# EAGLE schematic motion-sensor (EAGLE 7.4.0)
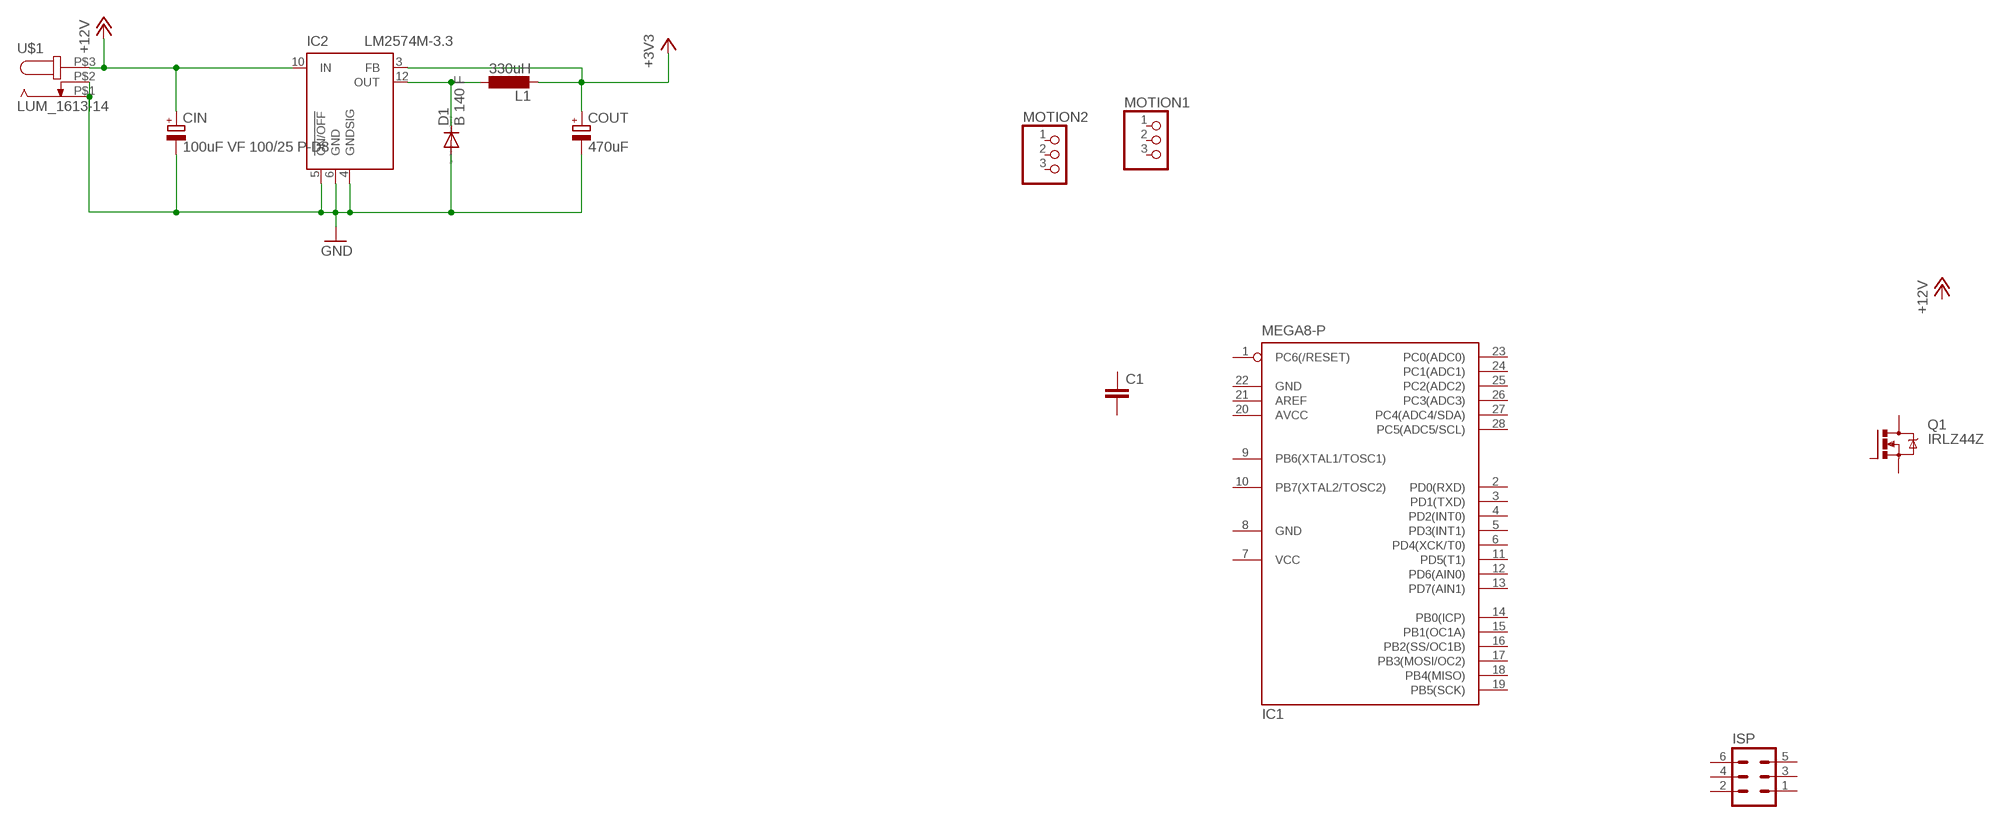
[diagram p0: schematic, sheet 1]

## Parts
C1  C-EU025-030X050  [C025-030X050]
CIN  100uF VF 100/25 P-D8  CPOL-EU153CLV-0605  [153CLV-0605]
COUT  470uF  CPOL-EU153CLV-0810  [153CLV-0810]
D1  B 140 F  DIODE-DO-214AC  [DO-214AC]
IC1  MEGA8-P  [DIL28-3]
IC2  LM2574M-3.3  [SO14W]
ISP  ML6  [ML6]
L1  330uH  PIS4728  [PIS2816]
MOTION1  PINHD-1X3  [1X03]
MOTION2  PINHD-1X3  [1X03]
Q1  IRLZ44Z  [TO220BH]
U$1  LUM_1613-14  [DCJ0202]

## Nets
+3V3: COUT.+ IC2.3(FB) L1.2
+12V: CIN.+ IC2.10(IN) U$1.P$3
GND: CIN.- COUT.- D1.A IC2.4(GNDSIG) IC2.5(!ON/OFF) IC2.6(GND) U$1.P$1 U$1.P$2
N$3: D1.C IC2.12(OUT) L1.1
Unconnected: C1.1 C1.2 IC1.1(PC6(/RESET)) IC1.2(PD0(RXD)) IC1.3(PD1(TXD)) IC1.4(PD2(INT0)) IC1.5(PD3(INT1)) IC1.6(PD4(XCK/T0)) IC1.9(PB6(XTAL1/TOSC1)) IC1.10(PB7(XTAL2/TOSC2)) IC1.11(PD5(T1)) IC1.12(PD6(AIN0)) IC1.13(PD7(AIN1)) IC1.14(PB0(ICP)) IC1.15(PB1(OC1A)) IC1.16(PB2(SS/OC1B)) IC1.17(PB3(MOSI/OC2)) IC1.18(PB4(MISO)) IC1.19(PB5(SCK)) IC1.21(AREF) IC1.23(PC0(ADC0)) IC1.24(PC1(ADC1)) IC1.25(PC2(ADC2)) IC1.26(PC3(ADC3)) IC1.27(PC4(ADC4/SDA)) IC1.28(PC5(ADC5/SCL)) ISP.1 ISP.2 ISP.3 ISP.4 ISP.5 ISP.6 MOTION1.1 MOTION1.2 MOTION1.3 MOTION2.1 MOTION2.2 MOTION2.3 Q1.D Q1.G Q1.S

## Power pins joined to a net without a drawn wire
AVCC: IC1.20(AVCC)
GND: IC1.8(GND) IC1.22(GND)
VCC: IC1.7(VCC)

## Library data of the parts
C1 = rcl:C-EU: CAPACITOR, European symbol
CIN = resistor:CPOL-EU: POLARIZED CAPACITOR, European symbol
COUT = rcl:CPOL-EU: POLARIZED CAPACITOR, European symbol
D1 = diode:DIODE-: DIODE
IC1 = atmel:MEGA8-P: MICROCONTROLLER 8 Kbytes FLASH, 1 kbytes SRAM, 512 bytes EEPROM, USART, 4-channel 10 bit ADC, 2-channel 8 bit ADC Pin compatible with Atmega48, ATMega88, ATMega168 Source: avr.lbr; OC_FARNELL: unknown; OC_NEWARK: unknown
IC2 = linear:LM2574?-*: SIMPLE SWITCHER 0.5A Step-Down Voltage Regulator Source: http://cache.national.com/ds/LM/LM2574.pdf
ISP = con-ml:ML6: HARTING; OC_FARNELL: unknown; OC_NEWARK: unknown
L1 = jbolay:PIS4728
MOTION1 MOTION2 = pinhead:PINHD-1X3: PIN HEADER
Q1 = transistor-power:IRLZ44Z: N-Channel HEXFET® Power MOSFET Logic Level AUTOMOTIVE MOSFET Source: http://www.irf.com/product-info/datasheets/data/irlz44zpbf.pdf
U$1 = jbolay:LUM_1613-14: Netzgeräte-Einbaukupplung, abgewinkelte Ausführung, mit Öffner, für Leiterplatten, Surface-Mount-Technik (SMT) Hohlstecker Reichelt Artikel-Nr.: LUM 1613-14